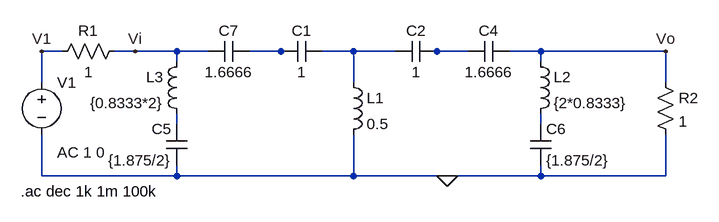
[diagram p0: schematic circ_normalizado.asc]
circ_normalizado.asc, the LTspice schematic file:
Version 4
SHEET 1 968 680
WIRE -16 64 -48 64
WIRE 96 64 64 64
WIRE 160 64 96 64
WIRE 208 64 160 64
WIRE 320 64 272 64
WIRE 336 64 320 64
WIRE 432 64 384 64
WIRE 496 64 432 64
WIRE 560 64 544 64
WIRE 608 64 560 64
WIRE 720 64 672 64
WIRE 912 64 720 64
WIRE 160 80 160 64
WIRE 720 80 720 64
WIRE -48 112 -48 64
WIRE 432 112 432 64
WIRE 912 112 912 64
WIRE 160 176 160 160
WIRE 720 176 720 160
WIRE -48 256 -48 192
WIRE 160 256 160 240
WIRE 160 256 -48 256
WIRE 432 256 432 192
WIRE 432 256 160 256
WIRE 576 256 432 256
WIRE 720 256 720 240
WIRE 720 256 576 256
WIRE 912 256 912 192
WIRE 912 256 720 256
FLAG 576 256 0
FLAG 912 64 Vo
FLAG 96 64 Vi
FLAG -48 64 V1
SYMBOL voltage -48 96 R0
WINDOW 123 24 124 Left 2
WINDOW 39 0 0 Left 0
SYMATTR Value2 AC 1 0
SYMATTR InstName V1
SYMATTR Value ""
SYMBOL res 80 48 R90
WINDOW 0 0 56 VBottom 2
WINDOW 3 32 56 VTop 2
SYMATTR InstName R1
SYMATTR Value 1
SYMBOL cap 384 48 R90
WINDOW 0 0 32 VBottom 2
WINDOW 3 32 32 VTop 2
SYMATTR InstName C1
SYMATTR Value 1
SYMBOL cap 560 48 R90
WINDOW 0 0 32 VBottom 2
WINDOW 3 32 32 VTop 2
SYMATTR InstName C2
SYMATTR Value 1
SYMBOL ind 416 96 R0
SYMATTR InstName L1
SYMATTR Value 0.5
SYMBOL ind 704 64 R0
SYMATTR InstName L2
SYMATTR Value {2*0.8333}
SYMBOL cap 704 176 R0
SYMATTR InstName C6
SYMATTR Value {1.875/2}
SYMBOL cap 608 80 R270
WINDOW 0 32 32 VTop 2
WINDOW 3 0 32 VBottom 2
SYMATTR InstName C4
SYMATTR Value 1.6666
SYMBOL res 896 96 R0
SYMATTR InstName R2
SYMATTR Value 1
SYMBOL ind 176 64 M0
SYMATTR InstName L3
SYMATTR Value {0.8333*2}
SYMBOL cap 176 176 M0
SYMATTR InstName C5
SYMATTR Value {1.875/2}
SYMBOL cap 272 80 M270
WINDOW 0 32 32 VTop 2
WINDOW 3 0 32 VBottom 2
SYMATTR InstName C7
SYMATTR Value 1.6666
TEXT -80 280 Left 2 !.ac dec 1k 1m 100k

The netlist it stands for:
* circ_normalizado.asc
V1 V1 0 AC 1 0
R1 Vi V1 1
C1 N002 N001 1
C2 N003 N002 1
L1 N002 0 0.5
L2 Vo N005 {2*0.8333}
C6 N005 0 {1.875/2}
C4 N003 Vo 1.6666
R2 Vo 0 1
L3 Vi N004 {0.8333*2}
C5 N004 0 {1.875/2}
C7 N001 Vi 1.6666
.ac dec 1k 1m 100k
.backanno
.end